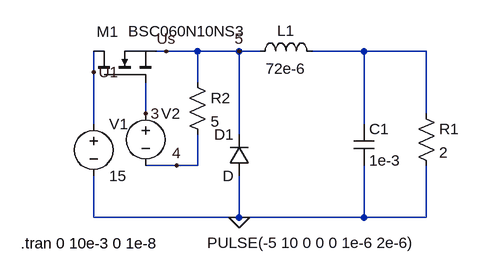
[diagram p0: schematic T1.asc]
T1.asc, the LTspice schematic file:
Version 4
SHEET 1 880 680
WIRE 112 0 96 0
WIRE 160 0 112 0
WIRE 224 0 160 0
WIRE 256 0 224 0
WIRE 416 0 336 0
WIRE 512 0 416 0
WIRE 0 32 0 0
WIRE 160 48 160 0
WIRE 80 96 80 48
WIRE 512 96 512 0
WIRE 0 112 0 32
WIRE 416 112 416 0
WIRE 224 128 224 0
WIRE 128 176 80 176
WIRE 160 176 160 128
WIRE 160 176 128 176
WIRE 0 256 0 192
WIRE 224 256 224 192
WIRE 224 256 0 256
WIRE 416 256 416 176
WIRE 416 256 224 256
WIRE 512 256 512 176
WIRE 512 256 416 256
FLAG 224 256 0
FLAG 112 0 Us
FLAG 0 32 U1
FLAG 80 96 3
FLAG 128 176 4
FLAG 224 0 5
SYMBOL voltage 0 96 R0
WINDOW 123 0 0 Left 0
WINDOW 39 0 0 Left 0
SYMATTR InstName V1
SYMATTR Value 15
SYMBOL diode 240 192 R180
WINDOW 0 24 64 Left 2
WINDOW 3 24 0 Left 2
SYMATTR InstName D1
SYMBOL ind 240 16 R270
WINDOW 0 32 56 VTop 2
WINDOW 3 5 56 VBottom 2
SYMATTR InstName L1
SYMATTR Value 72e-6
SYMBOL cap 400 112 R0
SYMATTR InstName C1
SYMATTR Value 1e-3
SYMBOL res 496 80 R0
SYMATTR InstName R1
SYMATTR Value 2
SYMBOL nmos 0 48 R270
WINDOW 0 78 5 VRight 2
WINDOW 3 79 53 VRight 2
SYMATTR InstName M1
SYMATTR Value BSC060N10NS3
SYMBOL voltage 80 80 R0
WINDOW 3 95 215 Left 2
WINDOW 123 0 0 Left 0
WINDOW 39 0 0 Left 0
SYMATTR Value PULSE(-5 10 0 0 0 1e-6 2e-6)
SYMATTR InstName V2
SYMBOL res 144 32 R0
SYMATTR InstName R2
SYMATTR Value 5
TEXT -112 296 Left 2 !.tran 0 10e-3 0 1e-8

The netlist it stands for:
* T1.asc
V1 U1 0 15
D1 0 5 D
L1 5 N001 72e-6
C1 N001 0 1e-3
R1 N001 0 2
M1 U1 3 5 5 BSC060N10NS3
V2 3 4 PULSE(-5 10 0 0 0 1e-6 2e-6)
R2 5 4 5
.model D D
.lib standard.dio
.model NMOS NMOS
.model PMOS PMOS
.lib standard.mos
.tran 0 10e-3 0 1e-8
.backanno
.end